# Altium schematic sheet MCU-ATMega328p.SchDoc
size A
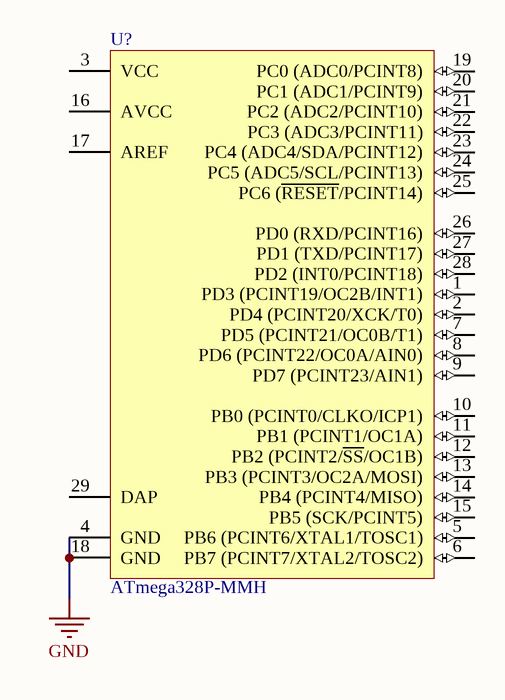
[diagram p0: MCU-ATMega328p.SchDoc]

## Parts
U?  ATmega328P-MMH  [28M1_N]

## Nets
GND: U?.4(GND) U?.18(GND)

Not connected (* = marked no-connect by the designer): U? 1(PD3_(PCINT19/OC2B/INT1)) 2(PD4_(PCINT20/XCK/T0)) 3(VCC) 5(PB6_(PCINT6/XTAL1/TOSC1)) 6(PB7_(PCINT7/XTAL2/TOSC2)) 7(PD5_(PCINT21/OC0B/T1)) 8(PD6_(PCINT22/OC0A/AIN0)) 9(PD7_(PCINT23/AIN1)) 10(PB0_(PCINT0/CLKO/ICP1)) 11(PB1_(PCINT1/OC1A)) 12(PB2_(PCINT2/~{SS}/OC1B)) 13(PB3_(PCINT3/OC2A/MOSI)) 14(PB4_(PCINT4/MISO)) 15(PB5_(SCK/PCINT5)) 16(AVCC) 17(AREF) 19(PC0_(ADC0/PCINT8)) 20(PC1_(ADC1/PCINT9)) 21(PC2_(ADC2/PCINT10)) 22(PC3_(ADC3/PCINT11)) 23(PC4_(ADC4/SDA/PCINT12)) 24(PC5_(ADC5/SCL/PCINT13)) 25(PC6_(~{RESET}/PCINT14)) 26(PD0_(RXD/PCINT16)) 27(PD1_(TXD/PCINT17)) 28(PD2_(INT0/PCINT18)) 29(DAP)

## Library data of the parts
U? = ATmega328P-MMH: 8-bit AVR Microcontroller, 32KB Flash, 1KB EEPROM, 2KB SRAM, 28-pin VQFN, Industrial Grade (-40°C to 85°C); DatasheetVersion: revD, May-2011; PackageVersion: revB, Nov-2008; PackageReference: 28M1; PackageDescription: 28-pad, 4x4x1.0mm Body, Pitch 0.45mm, 2.4x2.4mm Exposed Pad, Plastic Very Thin QFN Package (VQFN); ComponentLink1Description: Manufacturer URL; ComponentLink1URL: http://www.atmel.com/; ComponentLink2Description: ATmega48A/48PA/88A/88PA/168A/168PA/328/328P Datasheet; ComponentLink2URL: http://www.atmel.com/dyn/resources/prod_documents/8271.pdf; ComponentLink3Description: ATmega48A/48PA/88A/88PA/168A/168PA/328/328P Summary; ComponentLink3URL: http://www.atmel.com/dyn/resources/prod_documents/8271S.pdf